# EAGLE schematic RF_PA (EAGLE 9.6.2)
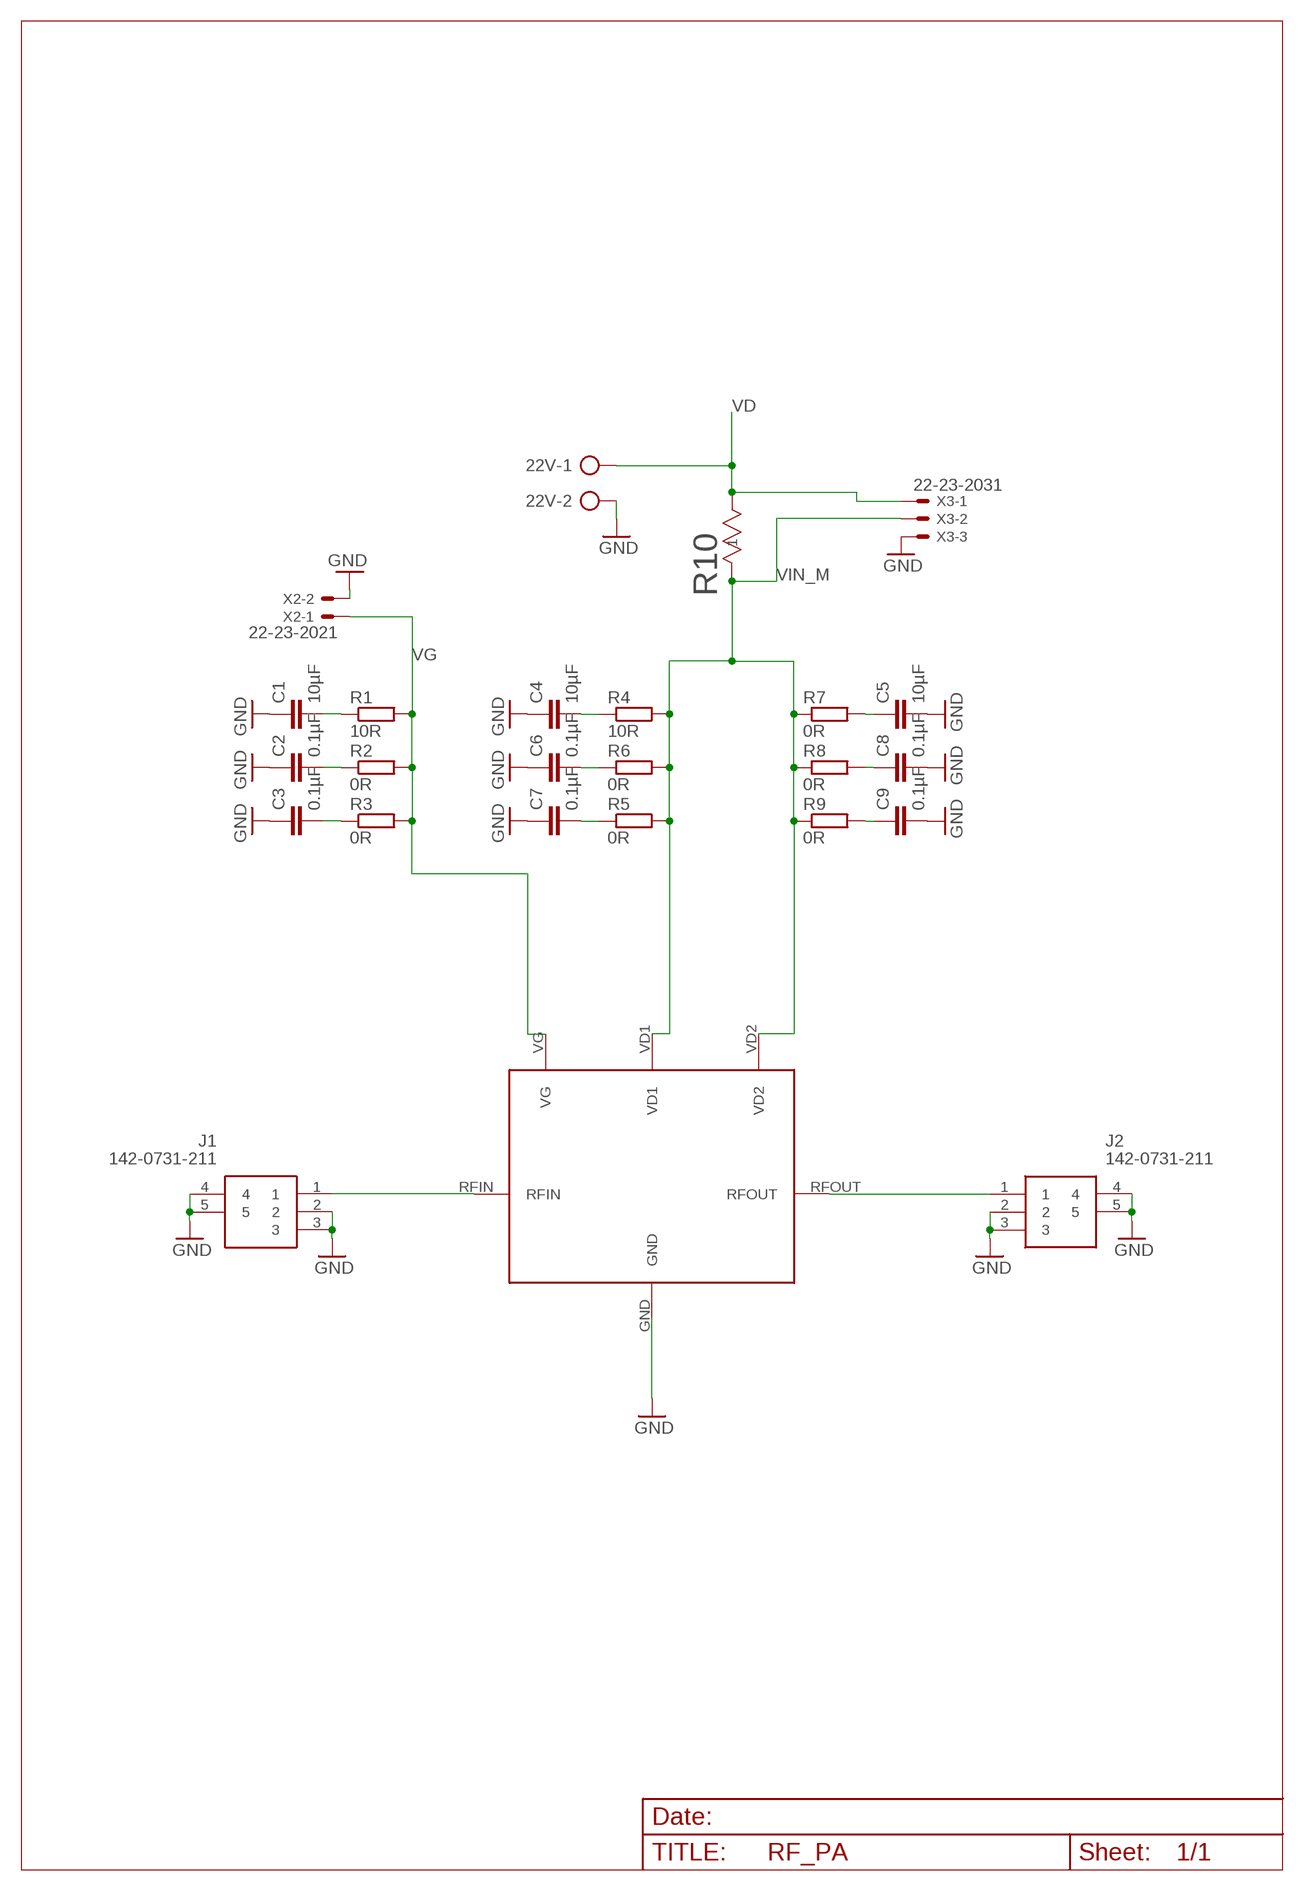
[diagram p0: schematic, sheet 1]

## Parts
22V  AK300/2  [AK300/2]
C1  10µF  C-EUC1206  [C1206]
C2  0.1µF  C-EUC0402  [C0402]
C3  0.1µF  C-EUC0402  [C0402]
C4  10µF  C-EUC1206  [C1206]
C5  10µF  C-EUC1206  [C1206]
C6  0.1µF  C-EUC0402  [C0402]
C7  0.1µF  C-EUC0402  [C0402]
C8  0.1µF  C-EUC0402  [C0402]
C9  0.1µF  C-EUC0402  [C0402]
J1  142-0731-211  [1420731211]
J2  142-0731-211  [1420731211]
R1  10R  R-EU_R0402  [R0402]
R2  0R  R-EU_R0402  [R0402]
R3  0R  R-EU_R0402  [R0402]
R4  10R  R-EU_R0402  [R0402]
R5  0R  R-EU_R0402  [R0402]
R6  0R  R-EU_R0603  [R0603]
R7  0R  R-EU_R0402  [R0402]
R8  0R  R-EU_R0402  [R0402]
R9  0R  R-EU_R0402  [R0402]
R10  5mR  WSL2816R1000FEH  [WSL2816_VIS]
U$1  QPA2962_B  [QPA2962_B]
X2  22-23-2021  [22-23-2021]
X3  22-23-2031  [22-23-2031]

## Nets
GND: 22V.2 C1.1 C2.1 C3.1 C4.1 C5.2 C6.1 C7.1 C8.2 C9.2 J1.2 J1.3 J1.4 J1.5 J2.2 J2.3 J2.4 J2.5 U$1.GND X2.2 X3.3
N$1: C3.2 R3.1
N$2: J1.1 U$1.RFIN
N$3: C1.2 R1.1
N$4: C2.2 R2.1
N$5: C4.2 R4.1
N$6: C6.2 R6.1
N$7: C7.2 R5.1
N$8: J2.1 U$1.RFOUT
N$10: C5.1 R7.2
N$11: C8.1 R8.2
N$12: C9.1 R9.2
VD: 22V.1 R10.2 X3.1
VG: R1.2 R2.2 R3.2 U$1.VG X2.1
VIN_M: R4.2 R5.2 R6.2 R7.1 R8.1 R9.1 R10.1 U$1.VD1 U$1.VD2 X3.2

## Library data of the parts
22V = con-ptr500:AK300/2: CONNECTOR; OC_FARNELL: unknown; OC_NEWARK: unknown
C1-C9 = rcl:C-EU: CAPACITOR, European symbol; SPICEPREFIX: C
J1 J2 = 142-0731-211:142-0731-211: SMA Connector Jack, Female Socket 50 Ohms Through Hole Solder Source: Datasheet <https://www.cinch.com/media/drawings/products/rf-microwave/connectors/dr-CCS-JOHNS-142-0731-211.pdf>; DESCRIPTION: SMA Connector Jack, Female Socket 50 Ohms Through Hole Solder; HEIGHT: 9.8852mm; MANUFACTURER_NAME: Cinch Connectivity Solutions; MANUFACTURER_PART_NUMBER: 142-0731-211; MOUSER_PART_NUMBER: 530-142-0731-211; MOUSER_PRICE-STOCK: https://www.mouser.co.uk/ProductDetail/Johnson-Cinch-Connectivity-Solutions/142-0731-211?qs=HFfMDpzxxd0OVzI3hm9tuA%3D%3D
R1-R9 = rcl:R-EU_: RESISTOR, European symbol; SPICEPREFIX: R
R10 = My_Library_RADAR:WSL2816R1000FEH; COPYRIGHT: Copyright (C) 2025 Ultra Librarian. All rights reserved.; DATASHEET: https://www.vishay.com/doc?30100; DESCRIPTION: WSL-2816 .1 1% EH e3; MANUFACTURER_NAME: Vishay; MANUFACTURER_PART_NUMBER: WSL2816R1000FEH
U$1 = My_Library_RADAR:QPA2962_B
X2 = con-molex:22-23-2021: .100" (2.54mm) Center Header - 2 Pin; MF: MOLEX; MPN: 22-23-2021; OC_FARNELL: 1462926; OC_NEWARK: 25C3832
X3 = con-molex:22-23-2031: .100" (2.54mm) Center Header - 3 Pin; MF: MOLEX; MPN: 22-23-2031; OC_FARNELL: 1462950; OC_NEWARK: 30C0862